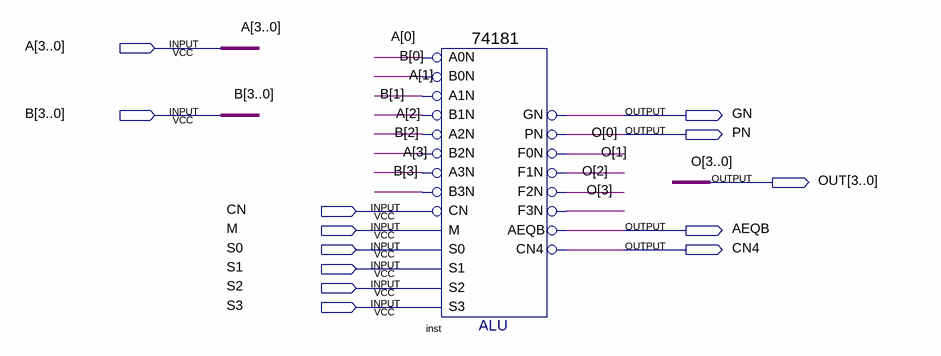
[diagram p0: schematic sheet]
// Quartus schematic t181.bdf as structural Verilog: 1 symbols, 13 pins
module t181 (
  input  [3:0] A,
  input  [3:0] B,
  input  CN,
  input  M,
  input  S0,
  input  S1,
  input  S2,
  input  S3,
  output GN,
  output PN,
  output [3:0] OUT,
  output AEQB,
  output CN4
);

  \74181  inst (
    .B0N(B[0]), .A0N(A[0]), .A1N(A[1]), .B1N(B[1]), .A3N(A[3]), .B2N(B[2]), .A2N(A[2]), .M(M), .CN(CN),
    .B3N(B[3]), .S2(S2), .S1(S1), .S0(S0), .S3(S3), .PN(PN), .GN(GN), .F3N(OUT[3]), .F1N(OUT[1]),
    .F0N(OUT[0]), .AEQB(AEQB), .CN4(CN4), .F2N(OUT[2]));

  // Other names for the same wires on the sheet: O[3:0] = OUT
endmodule
